# Altium schematic sheet TUSB320 Schematic.SchDoc
size A; SheetNumber: 1; SheetTotal: 2
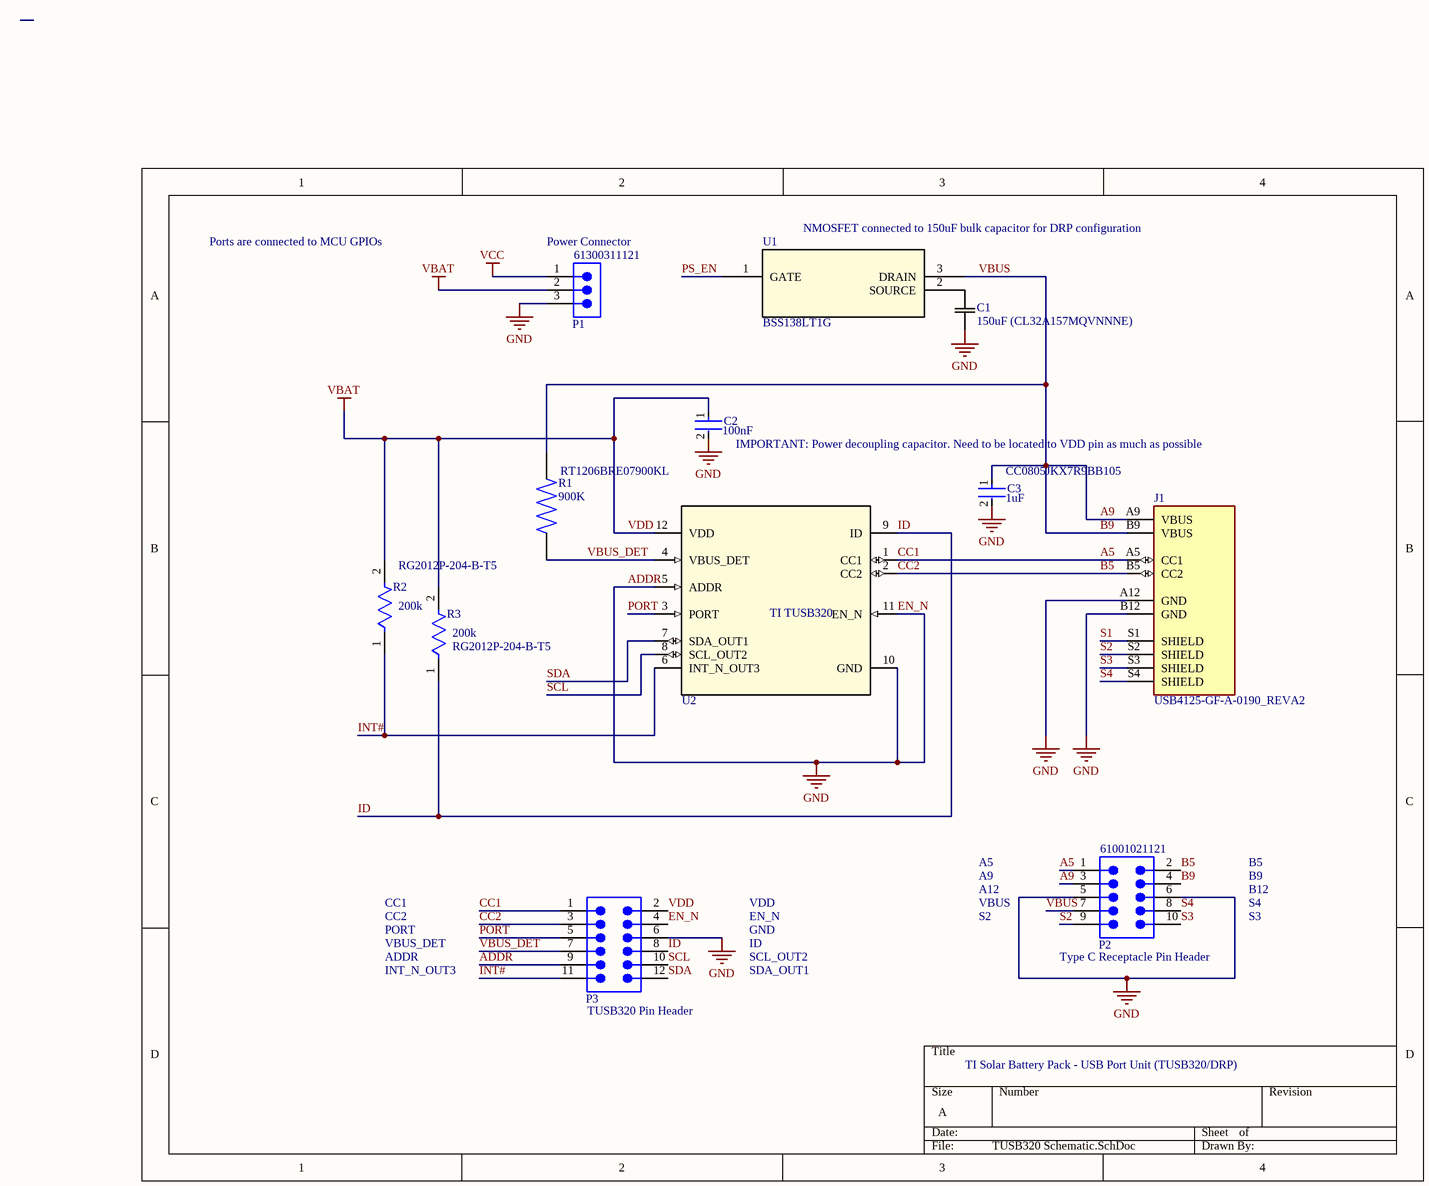
[diagram p0: TUSB320 Schematic.SchDoc]

## Parts
C1  150uF (CL32A157MQVNNNE)  [CAP_CL32_SAM]
C2  Capacitance: 100nF  [FP-GRMJN6-0_1-MFG]  (hidden comment: GRMJN65C1H104GE01J)
C3  CC0805JKX7R9BB105  Capacitance: 1uF  [FP-CC0805-0_2-1_45-MFG]
J1  USB4125-GF-A-0190_REVA2  [GCT_USB4125-GF-A-0190_REVA2]
P1  61300311121  [61300311121]
P2  61001021121  [61001021121]
P3  61001221121  [61001221121]  (value not drawn)
R1  RT1206BRE07900KL  value 900K  [RESC3116X65N]
R2  RG2012P-204-B-T5  Resistance: 200k  [FP-RG2012-IPC_B]
R3  RG2012P-204-B-T5  Resistance: 200k  [FP-RG2012-IPC_B]
U1  BSS138LT1G  [SOT-23-3_1P4X3P040_ONS]
U2  TI TUSB320  [RWB0012A]

## Nets
ADDR: C1.1 C2.2 C3.2 J1.A12(GND) J1.B12(GND) P1.3 P2.5 P2.6 P3.4 P3.6 P3.9 U2.5(ADDR) U2.10(GND) U2.11(EN_N)  [also labelled EN_N, GND]
VCC: P1.1
VDD: C2.1 P1.2 P3.2 R2.2 R3.2 U2.12(VDD)  [also labelled VBAT]
A5: J1.A5(CC1) P2.1 P3.1 U2.1(CC1)  [also labelled CC1]
A9: C3.1 J1.A9(VBUS) J1.B9(VBUS) P2.3 P2.4 P2.7 R1.2 U1.3(DRAIN)  [also labelled B9, VBUS]
B5: J1.B5(CC2) P2.2 P3.3 U2.2(CC2)  [also labelled CC2]
ID: P3.8 R3.1 U2.9(ID)
INT#: P3.11 R2.1 U2.6(INT_N_OUT3)
PORT: P3.5 U2.3(PORT)
PS_EN: U1.1(GATE)
S1: J1.S1(SHIELD)
S2: J1.S2(SHIELD) P2.9
S3: J1.S3(SHIELD) P2.10
S4: J1.S4(SHIELD) P2.8
SCL: P3.10 U2.8(SCL_OUT2)
SDA: P3.12 U2.7(SDA_OUT1)
VBUS_DET: P3.7 R1.1 U2.4(VBUS_DET)
NetC1_2: C1.2 U1.2(SOURCE)

## Notes on the sheet
- Ports are connected to MCU GPIOs
- (near P1) Power Connector
- (near U1) NMOSFET connected to 150uF bulk capacitor for DRP configuration
- IMPORTANT: Power decoupling capacitor. Need to be located to VDD pin as much as possible
- A5
- B5
- CC1
- CC2
- PORT
- VDD
- EN_N
- GND
- A9
- A12
- VBUS
- S2
- B9
- B12
- S4
- S3
- VBUS_DET
- ADDR
- INT_N_OUT3
- ID
- SCL_OUT2
- SDA_OUT1
- (near P2) Type C Receptacle Pin Header
- (near P3) TUSB320 Pin Header
- TI Solar Battery Pack - USB Port Unit (TUSB320/DRP)

## Library data of the parts
C1 = CL32A157MQVNNNE: No Description Available; Mfr_Name: Samsung
C2 = CMP-00260-135708738-1: GRMJN65C1H104GE01J Multilayer Ceramic Capacitor, 0.1 uF, 50 V, ± 2%, C0G (NP0), 0704 [1810 Metric]; Voltage Rating: 50V; Temperature Coefficient: 30ppm/°C; Material: Ceramic; Tolerance: 2%; Case/Package: 0704; NexarPartId: 135708738; Height: 650µm; Lifecycle Status: Production; Min Operating Temperature: -55°C; Max Operating Temperature: 125°C
C3 = CMP-03422-001528-1: CAP CER 1UF 50V X7R 0805; Tolerance: 5%; Max Operating Temperature: 125°C; Case/Package: 0805; Packaging: Cut Tape; Voltage Rating: 50V; Mount: Surface Mount; Case Code (Metric): 2012; Case Code (Imperial): 0805; Min Operating Temperature: -55°C
J1 = USB4125-GF-A-0190_REVA2: Type C Receptacle, Horizontal, SMT, For Power Charging Only; MF: Global Connector Technology; Price: None; Check_prices: https://www.snapeda.com/parts/USB4125-GF-A-0190/Global%20Connector%20Technology/view-part/6227012/?ref=eda; Package: None; Value: *; MP: USB4125-GF-A-0190; SnapEDA_Link: https://www.snapeda.com/parts/USB4125-GF-A-0190/Global%20Connector%20Technology/view-part/6227012/?ref=snap; Availability: No availability data
P1 = 61300311121: WR-PHD Pin Header, THT, Vertical, pitch 2.54mm, 1 Row, 3P; Manufacturer: Wurth Elektronik; Contact Resistance: 20mOhm; Rated Current: 3A; Working Voltage: 250V; Withstanding Voltage: 500V; Manufacturer Part Number: 61300311121; Category: Board-to-Board Connectors; Match Code: WR-PHD; ComponentLink1Description: Website Link; ComponentLink1URL: https://www.we-online.com/redexpert/article/61300311121?ad; ComponentLink2Description: Datasheet Link; ComponentLink2URL: https://www.we-online.com/redexpert/spec/61300311121?ad; Mount: Through Hole; Operating Temperature Max: 105°C; Operating Temperature Min: -40°C; Packaging: Bag; Gender: Pin Header; Number of Pins: 3; Number of Rows: 1; Orientation: Vertical; Pitch: 2.54mm
P2 = 61001021121: WR-PHD Pin Header, SMT, Vertical, pitch 2.54mm, 2 Row, 10P; Manufacturer: Wurth Elektronik; Contact Resistance: 20mOhm; Rated Current: 3A; Working Voltage: 250V; Withstanding Voltage: 500V; Manufacturer Part Number: 61001021121; Category: Board-to-Board Connectors; Match Code: WR-PHD; ComponentLink1Description: Website Link; ComponentLink1URL: https://www.we-online.com/redexpert/article/61001021121?ad; ComponentLink2Description: Datasheet Link; ComponentLink2URL: https://www.we-online.com/redexpert/spec/61001021121?ad; Mount: Surface Mount; Operating Temperature Max: 125°C; Operating Temperature Min: -40°C; Packaging: Tube; Gender: Pin Header; Number of Pins: 10; Number of Rows: 2; Orientation: Vertical; Pitch: 2.54mm
P3 = 61001221121: WR-PHD Pin Header, SMT, Vertical, pitch 2.54mm, 2 Row, 12P; Manufacturer: Wurth Elektronik; Contact Resistance: 20mOhm; Rated Current: 3A; Working Voltage: 250V; Withstanding Voltage: 500V; Manufacturer Part Number: 61001221121; Category: Board-to-Board Connectors; Match Code: WR-PHD; ComponentLink1Description: Website Link; ComponentLink1URL: https://www.we-online.com/redexpert/article/61001221121?ad; ComponentLink2Description: Datasheet Link; ComponentLink2URL: https://www.we-online.com/redexpert/spec/61001221121?ad; Mount: Surface Mount; Operating Temperature Max: 125°C; Operating Temperature Min: -40°C; Packaging: Tube; Gender: Pin Header; Number of Pins: 12; Number of Rows: 2; Orientation: Vertical; Pitch: 2.54mm
R2 R3 = CMP-2001-02831-2: Automotive Metal Thin Film Chip Resistor, 0805, 200kΩ, 0.1%, 25ppm/°C, 0.125W, 150V; Voltage Rating: 100V; Max Power Dissipation: 125mW; Power Rating: 100mW; Voltage Rating (DC): 150V; Resistor Type: Thin Film; Width: 1.25mm; Packaging: Tape and Reel; Temperature Coefficient: 25ppm/°C; Package Quantity: 5000; Case Code (Imperial): 0805; Length: 0.079inch; Min Operating Temperature: -55°C; Termination: SMD/SMT; RoHS Compliant: Yes; Tolerance: 0.1%; Series: RG; Number of Terminations: 2; Case/Package: 0805; Max Operating Temperature: 155°C; Lead Free: Lead Free; Height: 0.02inch; Case Code (Metric): 2012
U1 = BSS138LT1G: No Description Available; Mfr_Name: onsemi; RefDes: RefDes; Type: Type
U2 = TUSB320IRWBR: No Description Available; Mfr_Name: Texas Instruments; TYPE: TYPE; RefDes: RefDes
R1 = RT1206BRE07900KL: Package: None; Price: None; MP: RT1206BRE07900KL; Availability: Unavailable